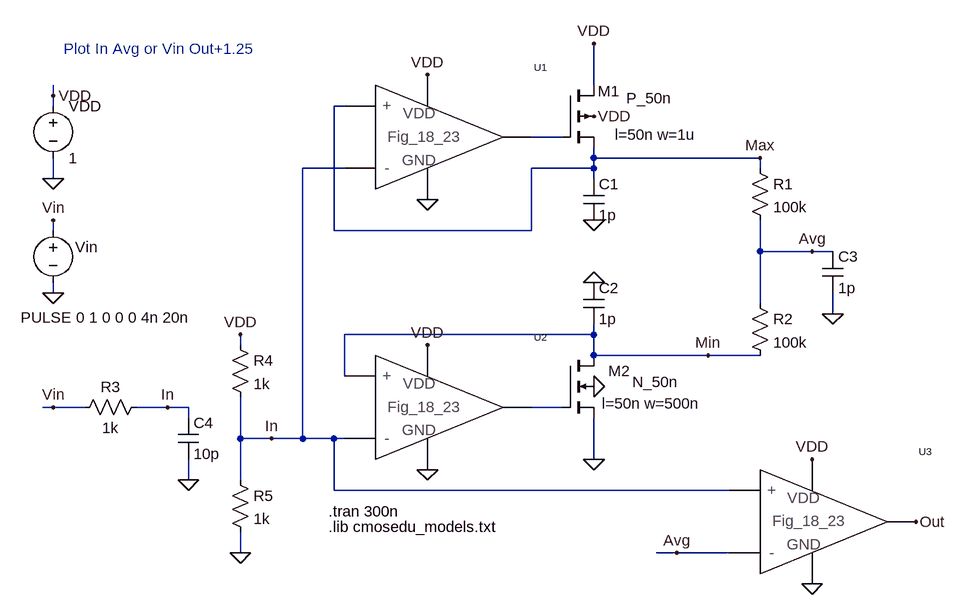
[diagram p0: schematic Fig18_31.asc]
Fig18_31.asc, the LTspice schematic file:
Version 4
SHEET 1 1764 680
WIRE 224 -880 224 -896
WIRE 224 -864 224 -880
WIRE 224 -752 224 -784
WIRE 224 -672 224 -688
WIRE 224 -576 224 -592
WIRE 224 -400 208 -400
WIRE 272 -400 224 -400
WIRE 400 -400 352 -400
WIRE 432 -400 400 -400
WIRE 432 -384 432 -400
WIRE 432 -288 432 -320
WIRE 512 -496 512 -512
WIRE 512 -352 512 -416
WIRE 512 -288 512 -352
WIRE 512 -176 512 -208
WIRE 560 -352 512 -352
WIRE 608 -352 560 -352
WIRE 608 -352 608 -768
WIRE 656 -672 656 -864
WIRE 656 -352 608 -352
WIRE 656 -272 656 -352
WIRE 672 -864 656 -864
WIRE 672 -768 608 -768
WIRE 672 -448 672 -512
WIRE 672 -352 656 -352
WIRE 960 -672 656 -672
WIRE 960 -672 960 -768
WIRE 1008 -816 960 -816
WIRE 1008 -400 960 -400
WIRE 1056 -896 1056 -960
WIRE 1056 -784 1056 -800
WIRE 1056 -768 960 -768
WIRE 1056 -768 1056 -784
WIRE 1056 -752 1056 -768
WIRE 1056 -512 672 -512
WIRE 1056 -512 1056 -528
WIRE 1056 -480 1056 -512
WIRE 1056 -320 1056 -384
WIRE 1184 -176 1152 -176
WIRE 1232 -480 1056 -480
WIRE 1264 -272 656 -272
WIRE 1264 -176 1184 -176
WIRE 1312 -784 1056 -784
WIRE 1312 -768 1312 -784
WIRE 1312 -640 1312 -688
WIRE 1312 -560 1312 -640
WIRE 1312 -480 1232 -480
WIRE 1392 -640 1312 -640
WIRE 1424 -640 1392 -640
WIRE 1424 -544 1424 -576
FLAG 224 -576 0
FLAG 224 -688 Vin
FLAG 224 -752 0
FLAG 224 -880 VDD
FLAG 800 -720 0
FLAG 800 -304 0
FLAG 800 -912 VDD
FLAG 800 -496 VDD
FLAG 560 -352 In
FLAG 1056 -848 VDD
FLAG 1056 -432 0
FLAG 1424 -544 0
FLAG 1056 -688 0
FLAG 1056 -592 0
FLAG 1056 -960 VDD
FLAG 1056 -320 0
FLAG 1392 -640 Avg
FLAG 1312 -784 Max
FLAG 1232 -480 Min
FLAG 1392 -320 VDD
FLAG 1392 -128 0
FLAG 1184 -176 Avg
FLAG 1552 -224 Out
FLAG 432 -288 0
FLAG 400 -400 In
FLAG 224 -400 Vin
FLAG 512 -512 VDD
FLAG 512 -176 0
SYMBOL voltage 224 -688 R0
WINDOW 0 34 41 Left 0
WINDOW 3 -50 150 Left 0
WINDOW 123 0 0 Left 0
WINDOW 39 0 0 Left 0
SYMATTR InstName Vin
SYMATTR Value PULSE 0 1 0 0 0 4n 20n
SYMBOL voltage 224 -880 R0
WINDOW 123 0 0 Left 0
WINDOW 39 0 0 Left 0
SYMATTR InstName VDD
SYMATTR Value 1
SYMBOL Fig_18_23 720 -816 R0
SYMATTR InstName U1
SYMBOL Fig_18_23 720 -400 R0
SYMATTR InstName U2
SYMBOL Fig_18_23 1312 -224 R0
SYMATTR InstName U3
SYMBOL pmos4 1008 -896 R0
WINDOW 0 88 9 Right 0
WINDOW 3 168 20 Right 0
WINDOW 123 206 76 Right 0
SYMATTR InstName M1
SYMATTR Value P_50n
SYMATTR Value2 l=50n w=1u
SYMBOL nmos4 1008 -480 R0
WINDOW 0 104 24 Right 0
WINDOW 3 179 41 Right 0
WINDOW 123 213 74 Right 0
SYMATTR InstName M2
SYMATTR Value N_50n
SYMATTR Value2 l=50n w=500n
SYMBOL cap 1040 -752 R0
SYMATTR InstName C1
SYMATTR Value 1p
SYMBOL cap 1040 -592 R0
SYMATTR InstName C2
SYMATTR Value 1p
SYMBOL cap 1408 -640 R0
SYMATTR InstName C3
SYMATTR Value 1p
SYMBOL res 1296 -784 R0
SYMATTR InstName R1
SYMATTR Value 100k
SYMBOL res 1296 -576 R0
SYMATTR InstName R2
SYMATTR Value 100k
SYMBOL res 256 -384 R270
WINDOW 0 32 56 VTop 0
WINDOW 3 0 56 VBottom 0
SYMATTR InstName R3
SYMATTR Value 1k
SYMBOL cap 416 -384 R0
SYMATTR InstName C4
SYMATTR Value 10p
SYMBOL res 496 -512 R0
SYMATTR InstName R4
SYMATTR Value 1k
SYMBOL res 496 -304 R0
SYMATTR InstName R5
SYMATTR Value 1k
TEXT 648 -240 Left 0 !.tran 300n
TEXT 648 -216 Left 0 !.lib cmosedu_models.txt
TEXT 240 -952 Left 0 ;Plot In Avg or Vin Out+1.25

The netlist it stands for:
* Fig18_31.asc
Vin Vin 0 PULSE 0 1 0 0 0 4n 20n
VDD VDD 0 1
XU1 Max In N001 VDD 0 Fig_18_23  ; pins Vinp Vinm Out VDD GND
XU2 Min In N002 VDD 0 Fig_18_23  ; pins Vinp Vinm Out VDD GND
XU3 In Avg Out VDD 0 Fig_18_23  ; pins Vinp Vinm Out VDD GND
M1 VDD N001 Max VDD P_50n l=50n w=1u
M2 Min N002 0 0 N_50n l=50n w=500n
C1 Max 0 1p
C2 0 Min 1p
C3 Avg 0 1p
R1 Max Avg 100k
R2 Avg Min 100k
R3 Vin In 1k
C4 In 0 10p
R4 VDD In 1k
R5 In 0 1k
.model NMOS NMOS
.model PMOS PMOS
.lib standard.mos
.tran 300n
.lib cmosedu_models.txt
* Plot In Avg or Vin Out+1.25
.backanno
.end